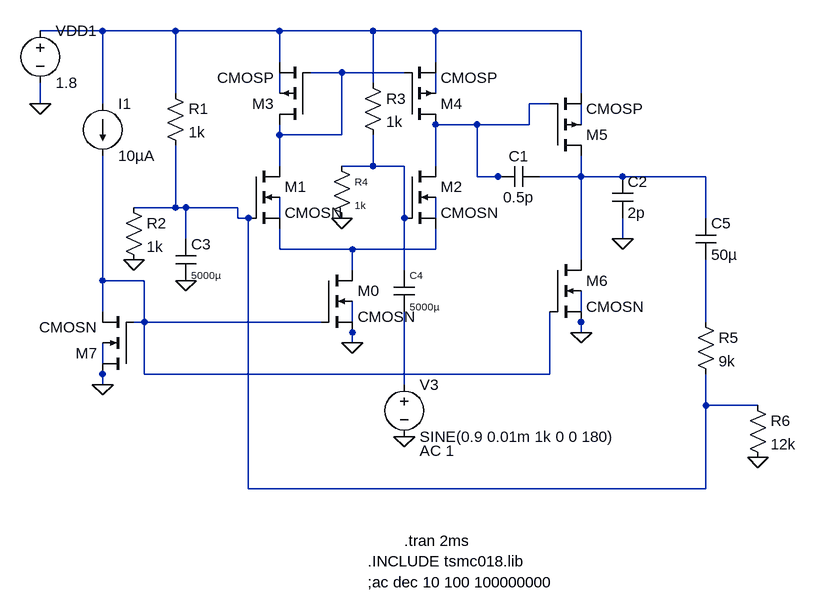
[diagram p0: schematic FinalOTA.asc]
FinalOTA.asc, the LTspice schematic file:
Version 4
SHEET 1 1108 984
WIRE 16 64 -80 64
WIRE 128 64 16 64
WIRE 288 64 128 64
WIRE 432 64 288 64
WIRE 528 64 432 64
WIRE 752 64 528 64
WIRE 288 112 288 64
WIRE 528 112 528 64
WIRE 384 128 336 128
WIRE 480 128 384 128
WIRE 432 144 432 64
WIRE 128 160 128 64
WIRE 288 160 288 128
WIRE 528 160 528 128
WIRE 752 160 752 64
WIRE -80 176 -80 144
WIRE 16 176 16 64
WIRE 704 176 672 176
WIRE 592 208 528 208
WIRE 672 208 672 176
WIRE 672 208 592 208
WIRE 752 208 752 176
WIRE 288 224 288 208
WIRE 384 224 384 128
WIRE 384 224 288 224
WIRE 288 272 288 224
WIRE 432 272 432 224
WIRE 432 272 384 272
WIRE 480 272 432 272
WIRE 528 272 528 208
WIRE 592 288 592 208
WIRE 624 288 592 288
WIRE 640 288 624 288
WIRE 752 288 752 256
WIRE 752 288 688 288
WIRE 816 288 752 288
WIRE 944 288 816 288
WIRE 128 336 128 240
WIRE 128 336 64 336
WIRE 144 336 128 336
WIRE 224 336 144 336
WIRE 224 352 224 336
WIRE 240 352 224 352
WIRE 288 352 288 320
WIRE 480 352 480 272
WIRE 528 352 528 320
WIRE 944 352 944 288
WIRE 144 384 144 336
WIRE 816 384 816 352
WIRE 288 400 288 368
WIRE 400 400 288 400
WIRE 528 400 528 368
WIRE 528 400 400 400
WIRE 752 416 752 288
WIRE 400 432 400 400
WIRE 480 432 480 352
WIRE 16 448 16 256
WIRE 80 448 16 448
WIRE 16 496 16 448
WIRE 80 512 80 448
WIRE 80 512 64 512
WIRE 352 512 80 512
WIRE 752 512 752 464
WIRE 944 512 944 416
WIRE 400 528 400 480
WIRE 752 528 752 512
WIRE 400 544 400 528
WIRE 16 592 16 544
WIRE 80 592 80 512
WIRE 704 592 704 496
WIRE 704 592 80 592
WIRE 16 608 16 592
WIRE 480 608 480 496
WIRE 944 640 944 592
WIRE 1024 640 944 640
WIRE 240 768 240 352
WIRE 944 768 944 640
WIRE 944 768 240 768
FLAG 400 544 0
FLAG 752 528 0
FLAG 16 608 0
FLAG 480 688 0
FLAG -80 176 0
FLAG 816 384 0
FLAG 64 416 0
FLAG 384 352 0
FLAG 1024 720 0
FLAG 144 448 0
SYMBOL current 16 176 R0
SYMATTR InstName I1
SYMATTR Value 10µA
SYMBOL cmosn 352 432 R0
SYMATTR InstName M0
SYMATTR Value2 l=900n w=19530n
SYMBOL cmosn 240 272 R0
SYMATTR InstName M1
SYMATTR Value2 l=900n w=48303n
SYMBOL cmosn 480 272 R0
SYMATTR InstName M2
SYMATTR Value2 l=900n w=48303n
SYMBOL cmosn 64 592 R180
SYMATTR InstName M7
SYMATTR Value2 l=900n w=1953n
SYMBOL cmosn 704 416 R0
SYMATTR InstName M6
SYMATTR Value2 l=900n w=19566n
SYMBOL cmosp 336 208 R180
SYMATTR InstName M3
SYMATTR Value2 l=900n w=22500n
SYMBOL cmosp 480 208 M180
SYMATTR InstName M4
SYMATTR Value2 l=900n w=22500n
SYMBOL cmosp 704 256 M180
SYMATTR InstName M5
SYMATTR Value2 l=900n w=42000n
SYMBOL voltage -80 48 R0
SYMATTR InstName VDD1
SYMATTR Value 1.8
SYMBOL voltage 480 592 R0
WINDOW 123 24 118 Left 2
SYMATTR Value2 AC 1
SYMATTR InstName V3
SYMATTR Value SINE(0.9 0.01m 1k 0 0 180)
SYMBOL cap 624 304 R270
WINDOW 0 32 32 VTop 2
WINDOW 3 0 32 VBottom 2
SYMATTR InstName C1
SYMATTR Value 0.5p
SYMBOL cap 800 288 R0
SYMATTR InstName C2
SYMATTR Value 2p
SYMBOL cap 128 384 R0
WINDOW 3 24 56 Left 1
SYMATTR Value 5000µ
SYMATTR InstName C3
SYMBOL cap 464 432 R0
WINDOW 0 24 8 Left 1
WINDOW 3 24 56 Left 1
SYMATTR InstName C4
SYMATTR Value 5000µ
SYMBOL res 112 144 R0
SYMATTR InstName R1
SYMATTR Value 1k
SYMBOL res 48 320 R0
SYMATTR InstName R2
SYMATTR Value 1k
SYMBOL res 416 128 R0
SYMATTR InstName R3
SYMATTR Value 1k
SYMBOL res 368 256 R0
WINDOW 0 36 40 Left 1
WINDOW 3 36 76 Left 1
SYMATTR InstName R4
SYMATTR Value 1k
SYMBOL res 928 496 R0
SYMATTR InstName R5
SYMATTR Value 9k
SYMBOL res 1008 624 R0
SYMATTR InstName R6
SYMATTR Value 12k
SYMBOL cap 928 352 R0
SYMATTR InstName C5
SYMATTR Value 50µ
TEXT 480 848 Left 2 !.tran 2ms
TEXT 424 880 Left 2 !.INCLUDE tsmc018.lib
TEXT 424 912 Left 2 !;ac dec 10 100 100000000

The netlist it stands for:
* FinalOTA.asc
I1 N001 N013 10µA
M0 N012 N013 0 0 CMOSN l=900n w=19530n
M1 N002 N009 N012 N010 CMOSN l=900n w=48303n
M2 N005 N007 N012 N011 CMOSN l=900n w=48303n
M7 0 N013 N013 0 CMOSN l=900n w=1953n
M6 N008 N013 0 0 CMOSN l=900n w=19566n
M3 N002 N002 N001 N003 CMOSP l=900n w=22500n
M4 N005 N002 N001 N004 CMOSP l=900n w=22500n
M5 N008 N005 N001 N006 CMOSP l=900n w=42000n
VDD1 N001 0 1.8
V3 N015 0 SINE(0.9 0.01m 1k 0 0 180) AC 1
C1 N005 N008 0.5p
C2 N008 0 2p
C3 N009 0 5000µ
C4 N007 N015 5000µ
R1 N001 N009 1k
R2 N009 0 1k
R3 N001 N007 1k
R4 N007 0 1k
R5 N014 N009 9k
R6 N009 0 12k
C5 N008 N014 50µ
.model NMOS NMOS
.model PMOS PMOS
.lib standard.mos
.tran 2ms
.INCLUDE tsmc018.lib
;ac dec 10 100 100000000
.backanno
.end